# Altium schematic sheet Remote_Schematic.SchDoc
size A; SheetNumber: 1; SheetTotal: 1
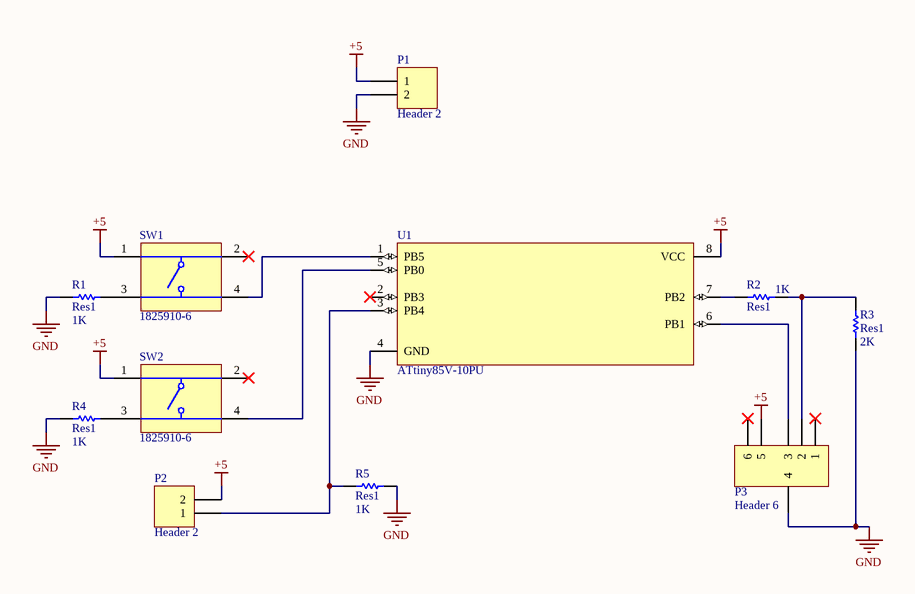
[diagram p0: Remote_Schematic.SchDoc]

## Parts
P1  Header 2  [HDR1X2]
P2  Header 2  [HDR1X2]
P3  Header 6  [HDR1X6]
R1  Res1  value 1K  [AXIAL-0.3]
R2  Res1  value 1K  [AXIAL-0.3]
R3  Res1  value 2K  [AXIAL-0.3]
R4  Res1  value 1K  [AXIAL-0.3]
R5  Res1  value 1K  [AXIAL-0.3]
SW1  1825910-6  [TECO-1825910-6_V]
SW2  1825910-6  [TECO-1825910-6_V]
U1  ATtiny85V-10PU  [8P3]

## Nets
+5: P1.1 P2.2 P3.5 SW1.1 SW2.1 U1.8(VCC)
GND: P1.2 P3.4 R1.2 R3.2 R4.2 R5.1 U1.4(GND)
NetP2_1: P2.1 R5.2 U1.3(PB4)
NetP3_2: P3.2 R2.2 R3.1
NetP3_3: P3.3 U1.6(PB1)
NetR1_1: R1.1 SW1.3
NetR2_1: R2.1 U1.7(PB2)
NetR4_1: R4.1 SW2.3
NetSW1_4: SW1.4 U1.1(PB5)
NetSW2_4: SW2.4 U1.5(PB0)

Not connected (* = marked no-connect by the designer): P3 1* 6*; SW1 2*; SW2 2*; U1 2(PB3)*

## Library data of the parts
P1 P2 = Header 2: Header, 2-Pin; LatestRevisionDate: 17-Jul-2002; LatestRevisionNote: Re-released for DXP Platform.; Publisher: Altium Limited
P3 = Header 6: Header, 6-Pin; LatestRevisionDate: 17-Jul-2002; LatestRevisionNote: Re-released for DXP Platform.; Publisher: Altium Limited
R1-R5 = Res1: Resistor; Published: 8-Jun-2000; LatestRevisionDate: 17-Jul-2002; LatestRevisionNote: Re-released for DXP Platform.; PackageReference: AXIAL-0.3; Publisher: Altium Limited; PackageDescription: Axial Device, Thru-Hole; 2 Leads; 0.3 in Pin Spacing
SW1 SW2 = CMP-1684-00021-1: Tact Switch, SPST-NO, 0.05 A, -35 to 85 degC, 4-Pin THD, RoHS, Bulk; Manufacturer: TE Connectivity; Maximum Contact Resistance: 100mOhm; Mechanical Life: 100000Cycles; Bushing Type: Unthreaded; Switch Configuration: OFF(ON); Maximum DC Voltage Rating: 24V; Contact Rating @ Voltage: 0.05A@24VDC; Actuator Color: Black; Body Orientation: Straight; Function: MomentaryContact; Illumination: N/R; Actuator Style: RoundButton; Actuator Material: PolybutyleneTerephthalate; Dielectric Strength: 500VAC; Pole Throw Configuration: SPST; Actuator Length: 1.4mm; Product Weight: N/A; Contact Material: CopperAlloy; Housing Material: N/A; Terminal Type: PCPins; Minimum Insulation Resistance: 100MOhm; Package Description: 4-Pin Through Hole Device, Body 5.99 x 5.99 mm, Pitch 6.5 mm; Part No: 1825910-6; Package Reference: THD; Base Material: N/A; Manufacturer URL: http://www.te.com; Contact Plating: Silver; RoHS: Yes; Datasheet Version: Rev. C9; Electrical Life: 100000Cycles; Maximum AC Voltage Rating: N/A; Thread Size: N/R; Operating Temperature: -35to85C; Mounting: ThroughHole; Dimension: 5.99x5mm; Datasheet URL: http://www.te.com/commerce/DocumentDelivery/DDEController?Action=showdoc&DocId=Customer+Drawing%7F1825910%7FC9%7Fpdf%7FEnglish%7FENG_CD_1825910_C9.pdf%7F1825910-6; Family: 1825910; Seal Location: N/A; Seal Description: N/A; Packaging: N/A
U1 = CMP-0093-00033-2: 8-bit AVR Microcontroller, 10MHz, 1.8-5.5V, 8K Flash, 512 Bytes EEPROM, 512 Bytes SRAM, Industrial Grade (-40°C to 85°C), 8-Lead PDIP, Pb-Free; ComponentLink3URL: http://www.atmel.com/dyn/resources/prod_documents/2586S.pdf; ComponentLink1Description: Manufacturer URL; PackageVersion: revB, Jan-2002; ComponentLink2Description: ATtiny25/45/85 Datasheet; PackageReference: 8P3; ComponentLink3Description: ATtiny25/45/85 Summary; ComponentLink2URL: http://www.atmel.com/dyn/resources/prod_documents/doc2586.pdf; Code_JEDEC: MS-001-BA; PackageDescription: 8-Lead, 0.300" Wide Body, Plastic Dual In-Line Package (PDIP); RevisionNote: DatasheetVersion updated. URLs added.; ComponentLink1URL: http://www.atmel.com/; DatasheetVersion: revN, Apr-2011